# Altium schematic sheet SAMD21J17A DEV BOARD.SchDoc
size A1
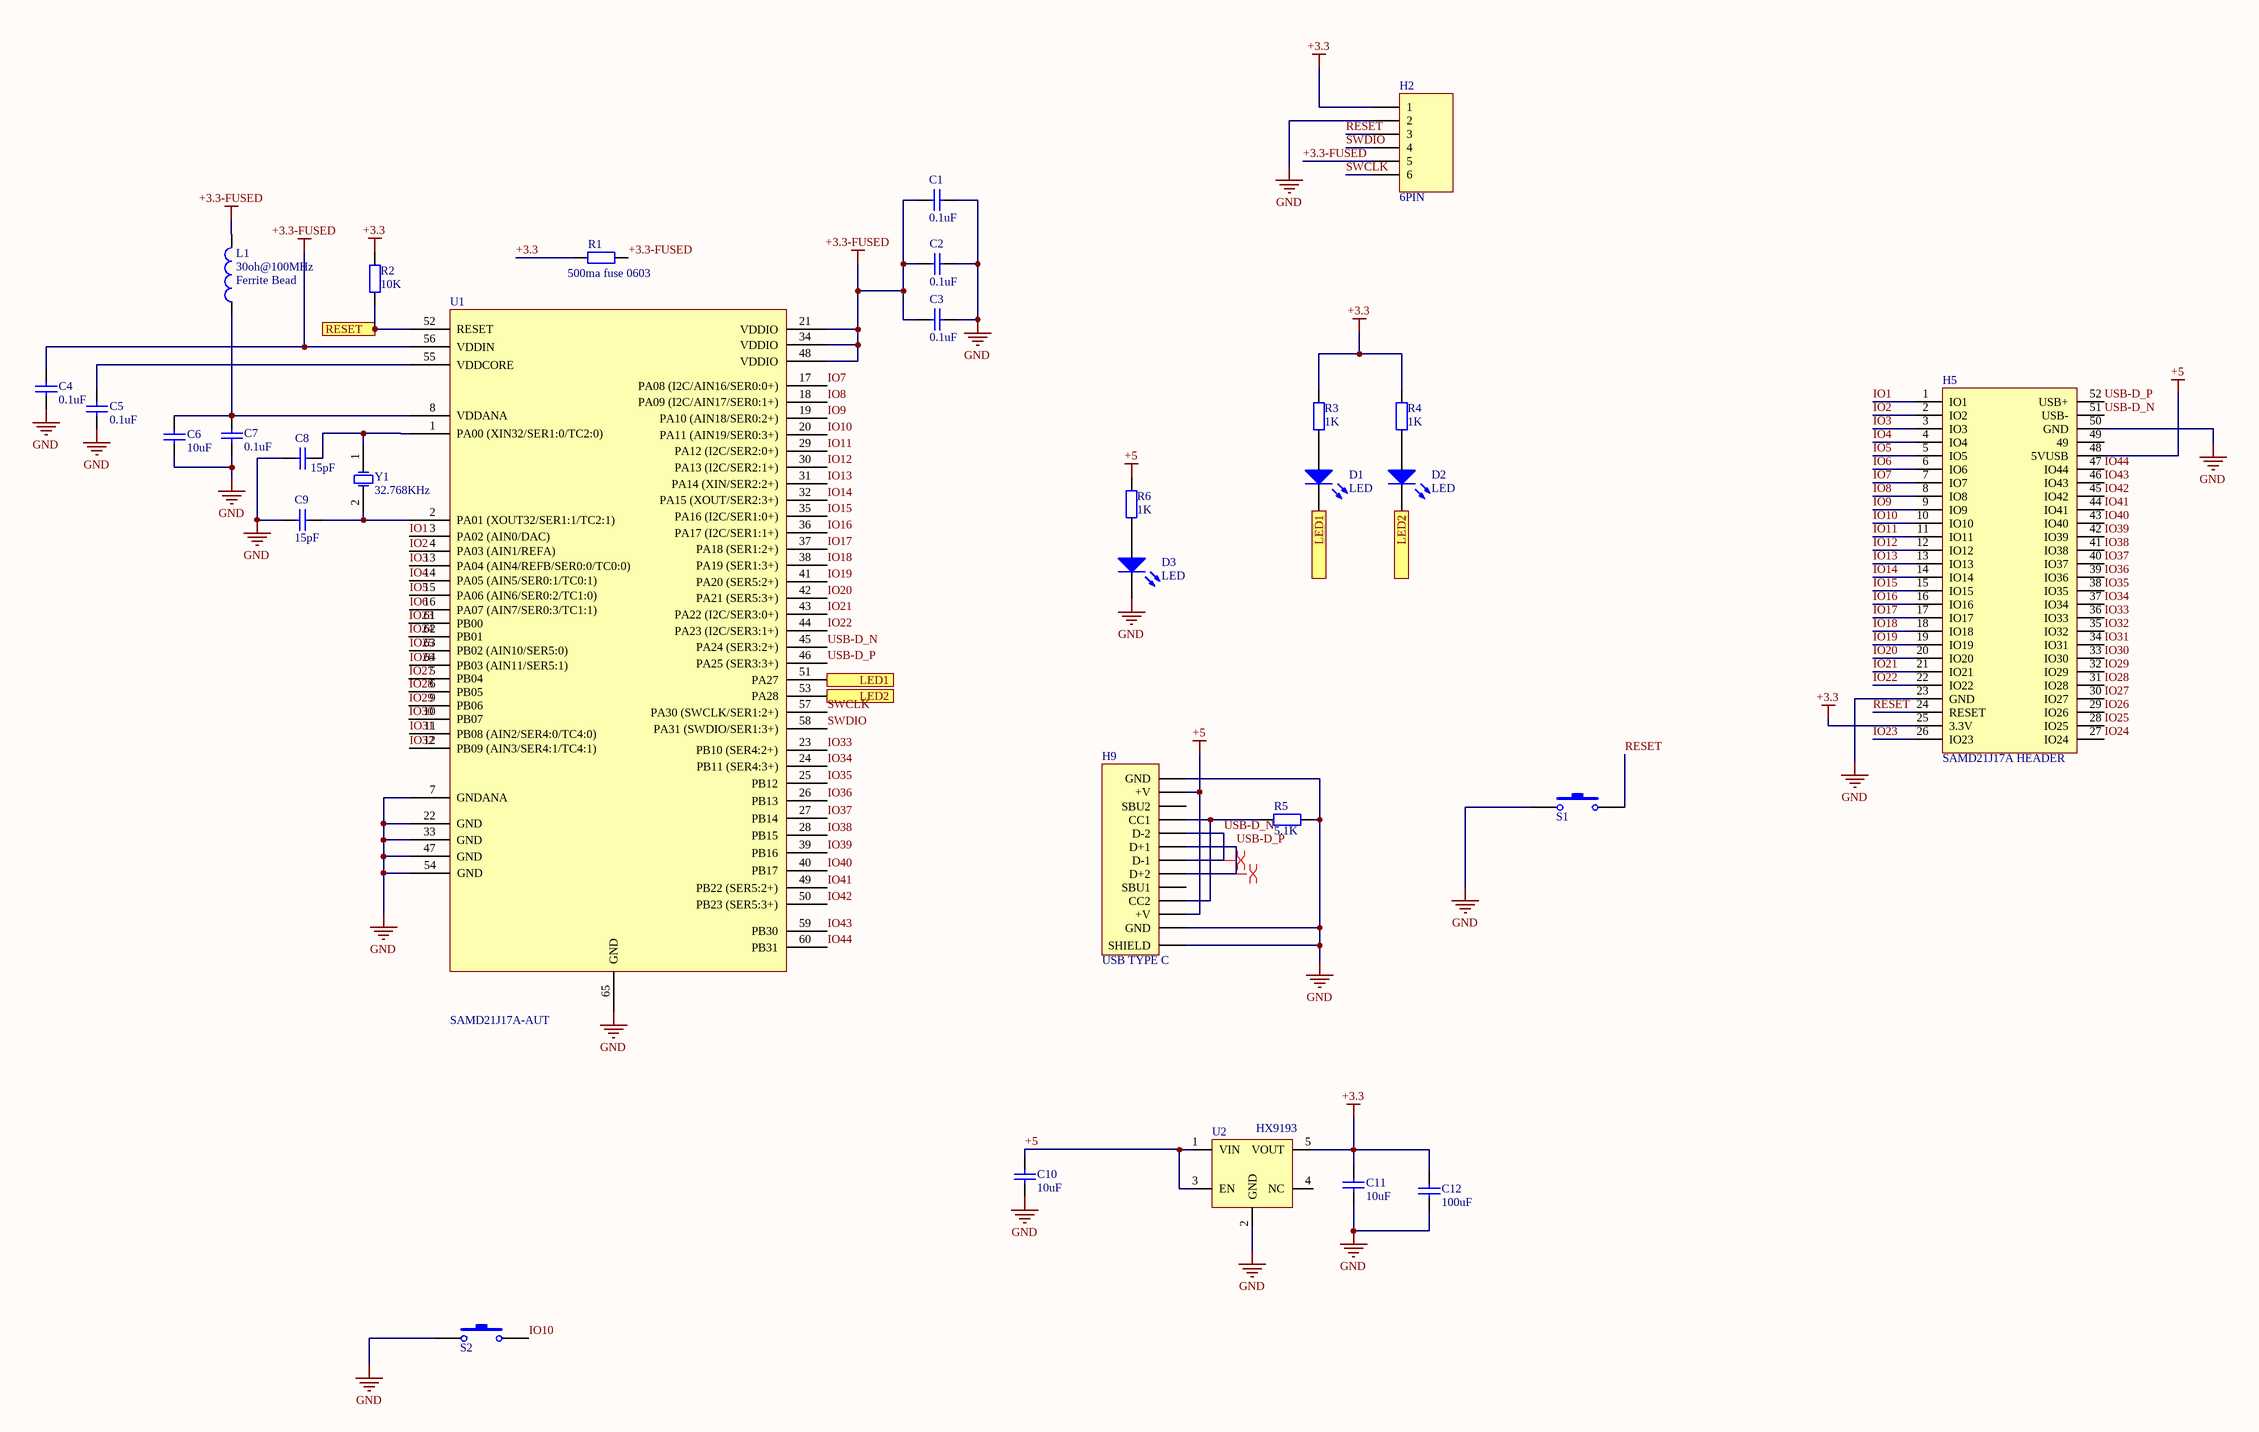
[diagram p0: SAMD21J17A DEV BOARD.SchDoc]

## Parts
C1  value 0.1uF  [0603 cap]  (hidden comment: Cap)
C2  value 0.1uF  [0603 cap]  (hidden comment: Cap)
C3  value 0.1uF  [0603 cap]  (hidden comment: Cap)
C4  value 0.1uF  [0603 cap]  (hidden comment: Cap)
C5  value 0.1uF  [0603 cap]  (hidden comment: Cap)
C6  value 10uF  [0603 cap]  (hidden comment: Cap)
C7  value 0.1uF  [0603 cap]  (hidden comment: Cap)
C8  value 15pF  [0603 cap]  (hidden comment: Cap)
C9  value 15pF  [0603 cap]  (hidden comment: Cap)
C10  value 10uF  [0805 cap]  (hidden comment: Cap)
C11  value 10uF  [0805 cap]  (hidden comment: Cap)
C12  value 100uF  [1206 CAP]  (hidden comment: Cap)
D1  LED  [0603 LED]
D2  LED  [0603 LED]
D3  LED  [0603 LED]
H2  6PIN  [HEADER 6PIN DUAL PROG]
H5  SAMD21J17A HEADER  [HEADER 52PIN]
H9  USB TYPE C  [USB TYPE C]
L1  value 30oh@100MHz  [0603 IND]  (hidden comment: Inductor)
R1  value 500ma fuse 0603  [0603 res]  (hidden comment: Res)
R2  value 10K  [0603 res]  (hidden comment: Res)
R3  value 1K  [0603 res]  (hidden comment: Res)
R4  value 1K  [0603 res]  (hidden comment: Res)
R5  value 5.1K  [0603 res]  (hidden comment: Res)
R6  value 1K  [0603 res]  (hidden comment: Res)
S1  Push button  [PUSH BUTTON-3x4.65mm]  (value not drawn)
S2  Push button  [PUSH BUTTON-3x4.65mm]  (value not drawn)
U1  SAMD21J17A-AUT  [QFN64_9x9]
U2  HX9193  [SOT23-5_N]
Y1  32.768KHz  [SMD_3215 - CRYSTAL]

## Ports
LED1, LED2, RESET

## Nets
+3.3: C11.2 C12.2 H2.1 H5.25(3.3V) R1.1 R2.2 R3.2 R4.2 U2.5(VOUT)
+3.3-FUSED: C1.2 C2.2 C3.2 C4.2 H2.5 L1.2 R1.2 U1.21(VDDIO) U1.34(VDDIO) U1.48(VDDIO) U1.56(VDDIN)
+5: C10.2 H5.48(5VUSB) H9.2(+V) H9.11(+V) R6.2 U2.1(VIN) U2.3(EN)
GND: C1.1 C2.1 C3.1 C4.1 C5.1 C6.1 C7.1 C8.1 C9.1 C10.1 C11.1 C12.1 D3.2(K) H2.2 H5.23(GND) H5.50(GND) H9.1(GND) H9.12(GND) H9.13(SHIELD) R5.2 S1.1 S2.1 U1.7(GNDANA) U1.22(GND) U1.33(GND) U1.47(GND) U1.54(GND) U1.65(GND) U2.2(GND)
IO1: H5.1(IO1) U1.3(PA02_(AIN0/DAC))
IO2: H5.2(IO2) U1.4(PA03_(AIN1/REFA))
IO3: H5.3(IO3) U1.13(PA04_(AIN4/REFB/SER0:0/TC0:0))
IO4: H5.4(IO4) U1.14(PA05_(AIN5/SER0:1/TC0:1))
IO5: H5.5(IO5) U1.15(PA06_(AIN6/SER0:2/TC1:0))
IO6: H5.6(IO6) U1.16(PA07_(AIN7/SER0:3/TC1:1))
IO7: H5.7(IO7) U1.17(PA08_(I2C/AIN16/SER0:0+))
IO8: H5.8(IO8) U1.18(PA09_(I2C/AIN17/SER0:1+))
IO9: H5.9(IO9) U1.19(PA10_(AIN18/SER0:2+))
IO10: H5.10(IO10) S2.2 U1.20(PA11_(AIN19/SER0:3+))
IO11: H5.11(IO11) U1.29(PA12_(I2C/SER2:0+))
IO12: H5.12(IO12) U1.30(PA13_(I2C/SER2:1+))
IO13: H5.13(IO13) U1.31(PA14_(XIN/SER2:2+))
IO14: H5.14(IO14) U1.32(PA15_(XOUT/SER2:3+))
IO15: H5.15(IO15) U1.35(PA16_(I2C/SER1:0+))
IO16: H5.16(IO16) U1.36(PA17_(I2C/SER1:1+))
IO17: H5.17(IO17) U1.37(PA18_(SER1:2+))
IO18: H5.18(IO18) U1.38(PA19_(SER1:3+))
IO19: H5.19(IO19) U1.41(PA20_(SER5:2+))
IO20: H5.20(IO20) U1.42(PA21_(SER5:3+))
IO21: H5.21(IO21) U1.43(PA22_(I2C/SER3:0+))
IO22: H5.22(IO22) U1.44(PA23_(I2C/SER3:1+))
IO23: H5.26(IO23) U1.61(PB00)
IO24: H5.27(IO24) U1.62(PB01)
IO25: H5.28(IO25) U1.63(PB02_(AIN10/SER5:0))
IO26: H5.29(IO26) U1.64(PB03_(AIN11/SER5:1))
IO27: H5.30(IO27) U1.5(PB04)
IO28: H5.31(IO28) U1.6(PB05)
IO29: H5.32(IO29) U1.9(PB06)
IO30: H5.33(IO30) U1.10(PB07)
IO31: H5.34(IO31) U1.11(PB08_(AIN2/SER4:0/TC4:0))
IO32: H5.35(IO32) U1.12(PB09_(AIN3/SER4:1/TC4:1))
IO33: H5.36(IO33) U1.23(PB10_(SER4:2+))
IO34: H5.37(IO34) U1.24(PB11_(SER4:3+))
IO35: H5.38(IO35) U1.25(PB12)
IO36: H5.39(IO36) U1.26(PB13)
IO37: H5.40(IO37) U1.27(PB14)
IO38: H5.41(IO38) U1.28(PB15)
IO39: H5.42(IO39) U1.39(PB16)
IO40: H5.43(IO40) U1.40(PB17)
IO41: H5.44(IO41) U1.49(PB22_(SER5:2+))
IO42: H5.45(IO42) U1.50(PB23_(SER5:3+))
IO43: H5.46(IO43) U1.59(PB30)
IO44: H5.47(IO44) U1.60(PB31)
LED1: D1.2(K) U1.51(PA27) ; port LED1
LED2: D2.2(K) U1.53(PA28) ; port LED2
RESET: R2.1 U1.52(RESET) ; port RESET
RESET: H2.3 H5.24(RESET) S1.2  [a separate net that carries the same name]
SWCLK: H2.6 U1.57(PA30_(SWCLK/SER1:2+))
SWDIO: H2.4 U1.58(PA31_(SWDIO/SER1:3+))
USB-D_N: H5.51(USB-) H9.5(D-2) H9.7(D-1) U1.45(PA24_(SER3:2+))
USB-D_P: H5.52(USB+) H9.6(D+1) H9.8(D+2) U1.46(PA25_(SER3:3+))
NetC5_2: C5.2 U1.55(VDDCORE)
NetC6_2: C6.2 C7.2 L1.1 U1.8(VDDANA)
NetC8_2: C8.2 U1.1(PA00_(XIN32/SER1:0/TC2:0)) Y1.1(OSC1)
NetC9_2: C9.2 U1.2(PA01_(XOUT32/SER1:1/TC2:1)) Y1.2(OSC2)
NetD1_1: D1.1(A) R3.1
NetD2_1: D2.1(A) R4.1
NetD3_1: D3.1(A) R6.1
NetH9_4: H9.4(CC1) H9.10(CC2) R5.1

Not connected (* = marked no-connect by the designer): H5 49; H9 3(SBU2) 9(SBU1); U2 4(NC)

## Layout directives
differential pair: USB-D_N, USB-D_P

## Library data of the parts
C1-C12 = Cap: Capacitor; Published: 8-Jun-2000; LatestRevisionDate: 17-Jul-2002; LatestRevisionNote: Re-released for DXP Platform.; PackageReference: RAD-0.3; Publisher: Altium Limited; PackageDescription: Radial Cap, Thru-Hole; 2 Leads; 0.3 in Pin Spacing
  C1-C9: Supplier Unit Price 1: 0.03; Supplier Unit Price 2: 0.03; Supplier 1: lcsc.com; Supplier 2: aliexpress.com
D1-D3 = LED: Typical BLUE SiC LED; Published: 8-Jun-2000; LatestRevisionDate: 17-Dec-2003; LatestRevisionNote: PCB Footprint replaced.; DatasheetVersion: 16-Apr-2002; PackageVersion: 16-Apr-2002; PackageReference: 3.5X2.8X1.9; Publisher: Altium Limited; PackageDescription: SM LED; 2 C-Bend Leads; Body 3.5 x 2.8 x 1.9 mm, inc leads (LxWxH typ)
H2 = 6PIN: Header 6PIN; LatestRevisionDate: 17-Jul-2002; LatestRevisionNote: Re-released for DXP Platform.; Publisher: Altium Limited
H9 = USB TYPE C: USB TYPE C 12 PIN; LatestRevisionDate: 17-Jul-2002; LatestRevisionNote: Re-released for DXP Platform.; Publisher: Altium Limited
L1 = Ferrite Bead: Decoupling/filtering inductor; Code_IEC: 1005; Published: 8-Jun-2000; LatestRevisionDate: 29-May-2009; LatestRevisionNote: IPC-7351 Footprint Added.; PackageReference: 0402-A; Publisher: Altium Limited; PackageDescription: Chip Inductor; Code_JEITA: 0402; Supplier Unit Price 1: 0.1; Supplier Unit Price 2: 0.1; Supplier 1: lcsc.com; Supplier 2: aliexpress.com; Type: Ferrite Bead
R1-R6 = Res: Resistor; Published: 8-Jun-2000; LatestRevisionDate: 17-Jul-2002; LatestRevisionNote: Re-released for DXP Platform.; PackageReference: AXIAL-0.4; Publisher: Altium Limited; PackageDescription: Axial Device, Thru-Hole; 2 Leads; 0.4 in Pin Spacing; Supplier 2: aliexpress.com; Supplier Unit Price 2: 0.01; Supplier Unit Price 1: 0.0046; Supplier 1: lcsc.com
S1 S2 = Push button: Push button (C318895); Published: 24-Mar-1999; LatestRevisionDate: 17-Jul-2002; LatestRevisionNote: Re-released for DXP Platform.; PackageReference: SPST-2; Publisher: Altium Limited; PackageDescription: Switch; 2 Leads
U1 = SAMD21J17A-AUT: Low-Power, 32-bit Cortex-M0+ MCU with Advanced Analog / and PWM
U2 = HX9193: 3.3V Fixed Output Voltage Regulator
Y1 = XTAL 2p: Crystal; value: 16MHz; Published: 8-Jun-2000; LatestRevisionDate: 17-Jul-2002; LatestRevisionNote: Re-released for DXP Platform.; PackageReference: R38; Publisher: Altium Limited; PackageDescription: Crystal, Thru-Hole; 2 Leads; Body 3.1 x 8.2 mm (Dia.xH); Supplier Unit Price 1: 0.1; Supplier 1: lcsc.com; Supplier 2: aliexpress.com; Supplier Unit Price 2: 0.1